# EAGLE design TowCam Rev. A (EAGLE 9.4.2)
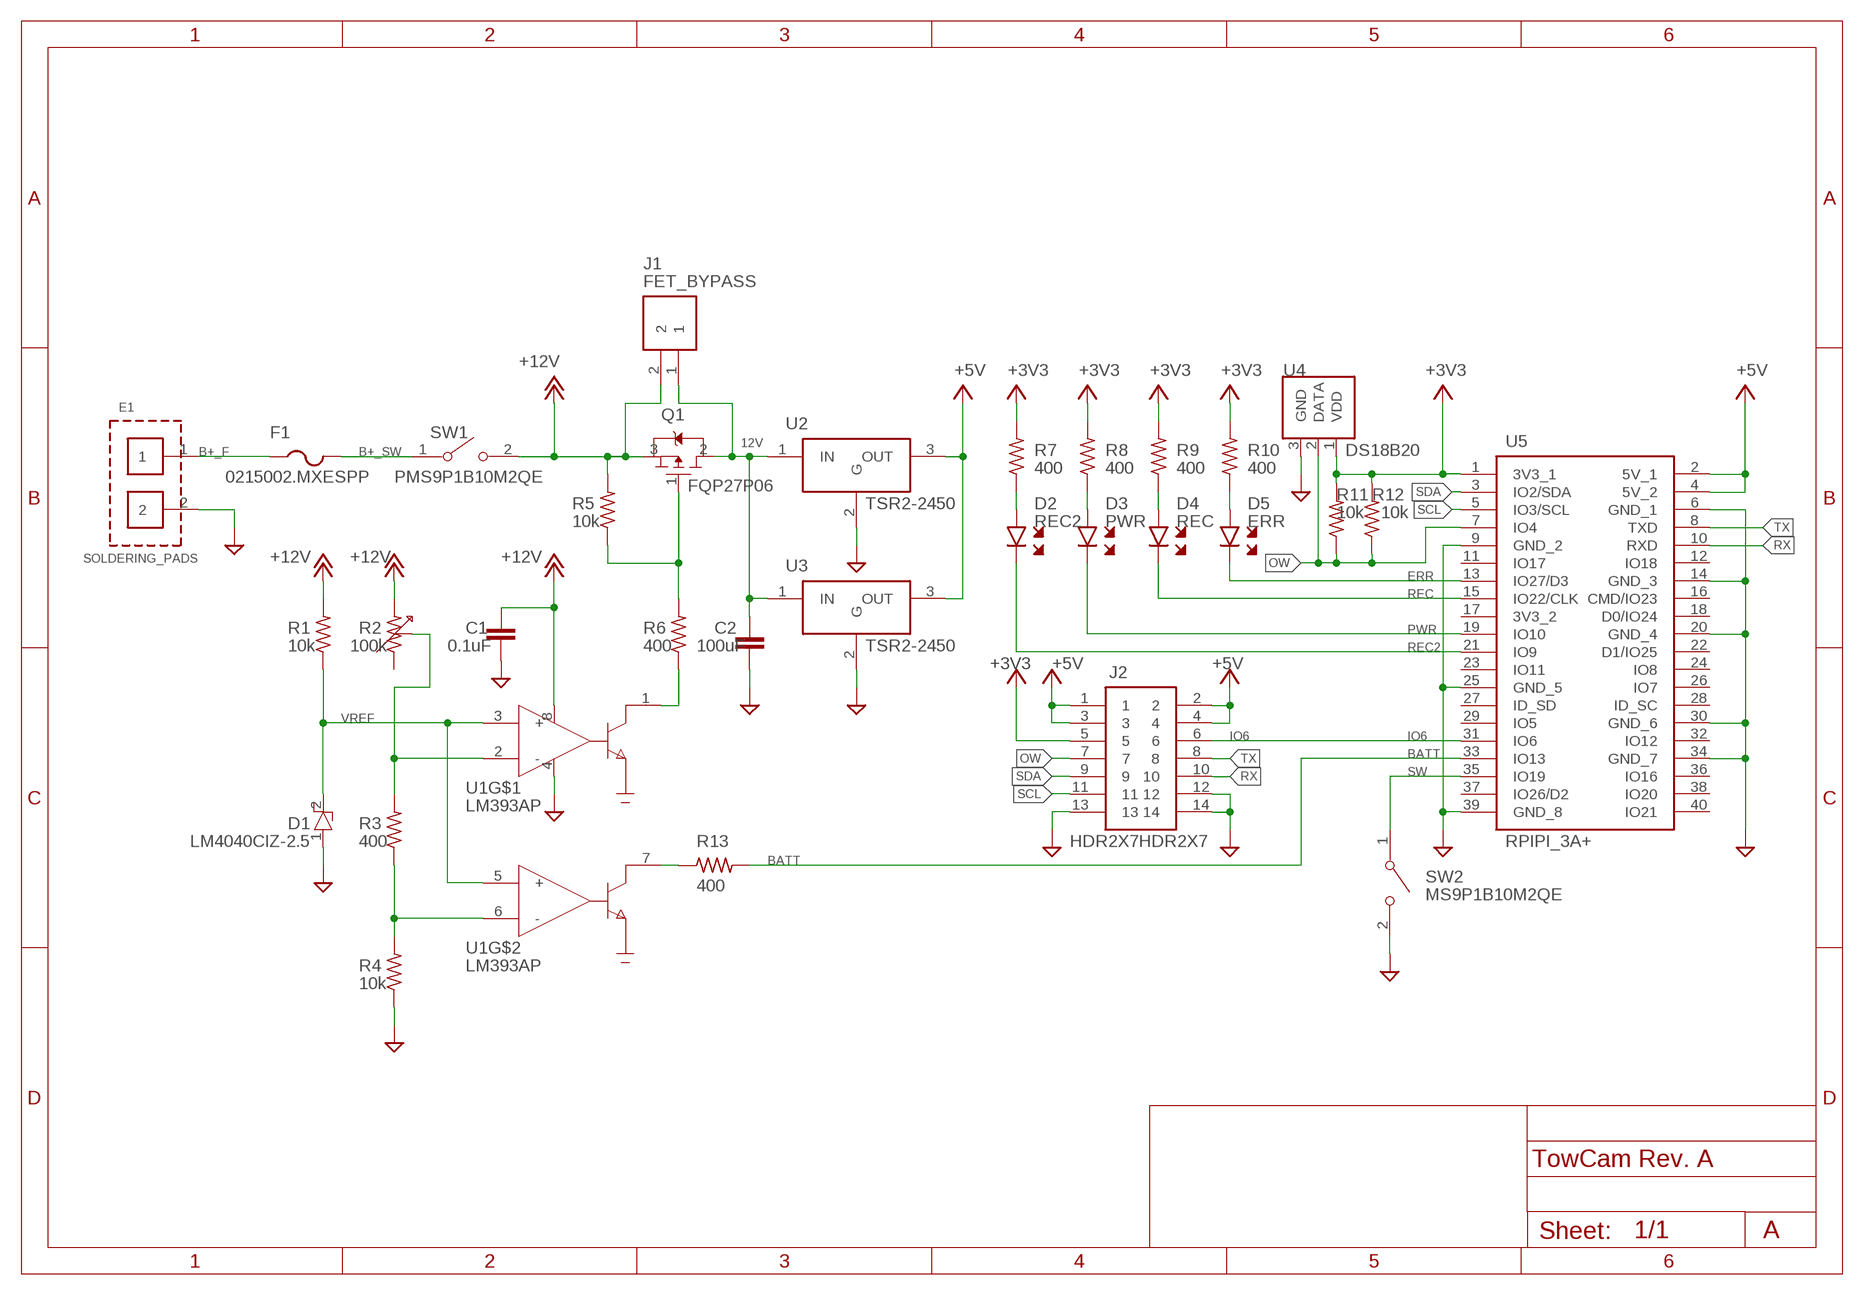
[diagram p0: schematic, sheet 1]

## Parts
C1  0.1uF  CAPACITORRAD-3MM  [CAPPRD254W65D300H300B]
C2  100uF  CAP_THCAP-TH-5MM  [CAP-TH-5MM]
D1  LM4040CIZ-2.5  ZENERLM4040CIZ-2.5  [TO-92]
D2  REC2  LED_THLED-2.54  [LEDRD254W60D565H860B]
D3  PWR  LED0805  [R0805]
D4  REC  LED0805  [R0805]
D5  ERR  LED0805  [R0805]
E1  SOLDERING_PADS  [SOLDERING_PADS]
F1  0215002.MXESPP  FUSE0215002.MXESPP  [0215002.MXESPP]
J1  FET_BYPASS  HDR1X22P2.54MM  [HDR1X2]
J2  HDR2X7HDR2X7  [HDR2X7]
Q1  FQP27P06  [TO-220-BEND]
R1  10k  RESISTOR0805  [R0805]
R2  100k  PV36W104C01B00  [PV36W104C01B00]
R3  400  RESISTOR0805  [R0805]
R4  10k  RESISTOR0805  [R0805]
R5  10k  RESISTOR0805  [R0805]
R6  400  RESISTOR0805  [R0805]
R7  400  RESISTOR0805  [R0805]
R8  400  RESISTOR0805  [R0805]
R9  400  RESISTOR0805  [R0805]
R10  400  RESISTOR0805  [R0805]
R11  10k  RESISTOR0805  [R0805]
R12  10k  RESISTOR0805  [R0805]
R13  400  RESISTOR0805  [R0805]
SW1  PMS9P1B10M2QE  SPSTPMS9P1B10M2QE  [PMS9P1B10M2QE]
SW2  MS9P1B10M2QE  SPSTPMS9P1B10M2QE  [PMS9P1B10M2QE]
U1  LM393AP  LM393APDIP8  [DIP8]
U2  TSR2-2450  [TSR2-2450]
U3  TSR2-2450  [TSR2-2450]
U4  DS18B20  [TO-92]
U5  RPIPI_3A+  [PI_3A+]

## Nets
12V: C2.1 J1.1 Q1.2(D) U2.1(IN) U3.1(IN)
+3V3: J2.5 R7.2 R8.2 R9.2 R10.2 R11.2 R12.2 U4.1(VDD) U5.1(3V3_1)
+5V: J2.1 J2.2 J2.3 J2.4 U2.3(OUT) U3.3(OUT) U5.2(5V_1) U5.4(5V_2)
+12V: C1.1 J1.2 Q1.3(S) R1.2 R2.3 R5.2 SW1.2 U1.8(VCC)
B+_F: E1.1 F1.1
B+_SW: F1.2 SW1.1
BATT: R13.2 U5.33(IO13)
ERR: D5.2 U5.13(IO27/D3)
GATE: Q1.1(G) R5.1 R6.2
GND: C1.2 C2.2 D1.1(A) E1.2 J2.12 J2.13 J2.14 R4.1 SW2.2 U1.4(GND) U2.2(G) U3.2(G) U4.3(GND) U5.6(GND_1) U5.9(GND_2) U5.14(GND_3) U5.20(GND_4) U5.25(GND_5) U5.30(GND_6) U5.34(GND_7) U5.39(GND_8)
IO6: J2.6 U5.31(IO6)
N$1: R13.1 U1.7(OUT)
N$3: R2.2 R3.2 U1.2(-)
N$4: R3.1 R4.2 U1.6(-)
N$5: D2.1 R7.1
N$6: R6.1 U1.1(OUT)
N$7: D3.1 R8.1
N$8: D4.1 R9.1
N$17: D5.1 R10.1
OW: J2.7 R11.1 R12.1 U4.2(DATA) U5.7(IO4)
PWR: D3.2 U5.19(IO10)
REC: D4.2 U5.15(IO22/CLK)
REC2: D2.2 U5.21(IO9)
RX: J2.10 U5.10(RXD)
SCL: J2.11 U5.5(IO3/SCL)
SDA: J2.9 U5.3(IO2/SDA)
SW: SW2.1 U5.35(IO19)
TX: J2.8 U5.8(TXD)
VREF: D1.2(C) R1.1 U1.3(+) U1.5(+)
Unconnected: R2.1 U5.11(IO17) U5.12(IO18) U5.16(CMD/IO23) U5.17(3V3_2) U5.18(D0/IO24) U5.22(D1/IO25) U5.23(IO11) U5.24(IO8) U5.26(IO7) U5.27(ID_SD) U5.28(ID_SC) U5.29(IO5) U5.32(IO12) U5.36(IO16) U5.37(IO26/D2) U5.38(IO20) U5.40(IO21)

## Notes on the sheet
- A

## Library data of the parts
C1 = CameraTags:CAPACITOR: Capacitor
C2 = CameraTags:CAP_TH: Capacitor Electro. TH
D1 = CameraTags:ZENER: Voltage Reference - Zener Diode
D2 = CameraTags:LED_TH: TH LED - large
D3-D5 = CameraTags:LED: LED GENERIC
E1 = CameraTags:SOLDERING_PADS: Pads for soldering wires
F1 = CameraTags:FUSE: Fuse - Various Devices
J1 = CameraTags:HDR1X2: Header 2pin 2.54mm pitch
J2 = CameraTags:HDR2X7
Q1 = CameraTags:FQP27P06: FQP27P06 ON Semiconductor P-Channel 60V 27A (Tc) 120W (Tc) Through Hole TO-220-3 https://www.digikey.com/product-detail/en/on-semiconductor/FQP27P06/FQP27P06-ND/965349
R1 R3-R13 = CameraTags:RESISTOR: Resistor US
R2 = CameraTags:PV36W104C01B00: PV36W104C01B00 Bourns Inc. 100 kOhms 0.5W, 1/2W PC Pins Through Hole Trimmer Potentiometer Cermet 25 Turn Top Adjustment https://www.digikey.ca/product-detail/en/bourns-inc/PV36W104C01B00/490-2876-ND/666503?_ga=2.74236242.1700050440.1575291731-1677524200.1568829916
SW1 SW2 = CameraTags:SPST: Switch SPST
U1 = CameraTags:LM393AP: LM393AP Texas Instruments Comparator Differential CMOS, MOS, Open-Drain, TTL 8-PDIP https://www.digikey.ca/product-detail/en/texas-instruments/LM393AP/296-6609-5-ND/372797
U2 U3 = CameraTags:TSR2-2450: TSR 2-2450 Traco Power Linear Regulator Replacement DC DC Converter 1 Output 5V 2A 6.5V - 36V Input https://www.digikey.ca/product-detail/en/traco-power/TSR-2-2450/1951-2692-ND/9383726
U4 = CameraTags:DS18B20: DS18B20+T&R Maxim Integrated Temperature Sensor Digital, Local -55°C ~ 125°C 12 b TO-92-3 https://www.digikey.ca/product-detail/en/maxim-integrated/DS18B20-T-R/DS18B20-T-RCT-ND/3478852
U5 = CameraTags:RPI: Pi Header with different package variations

## Board
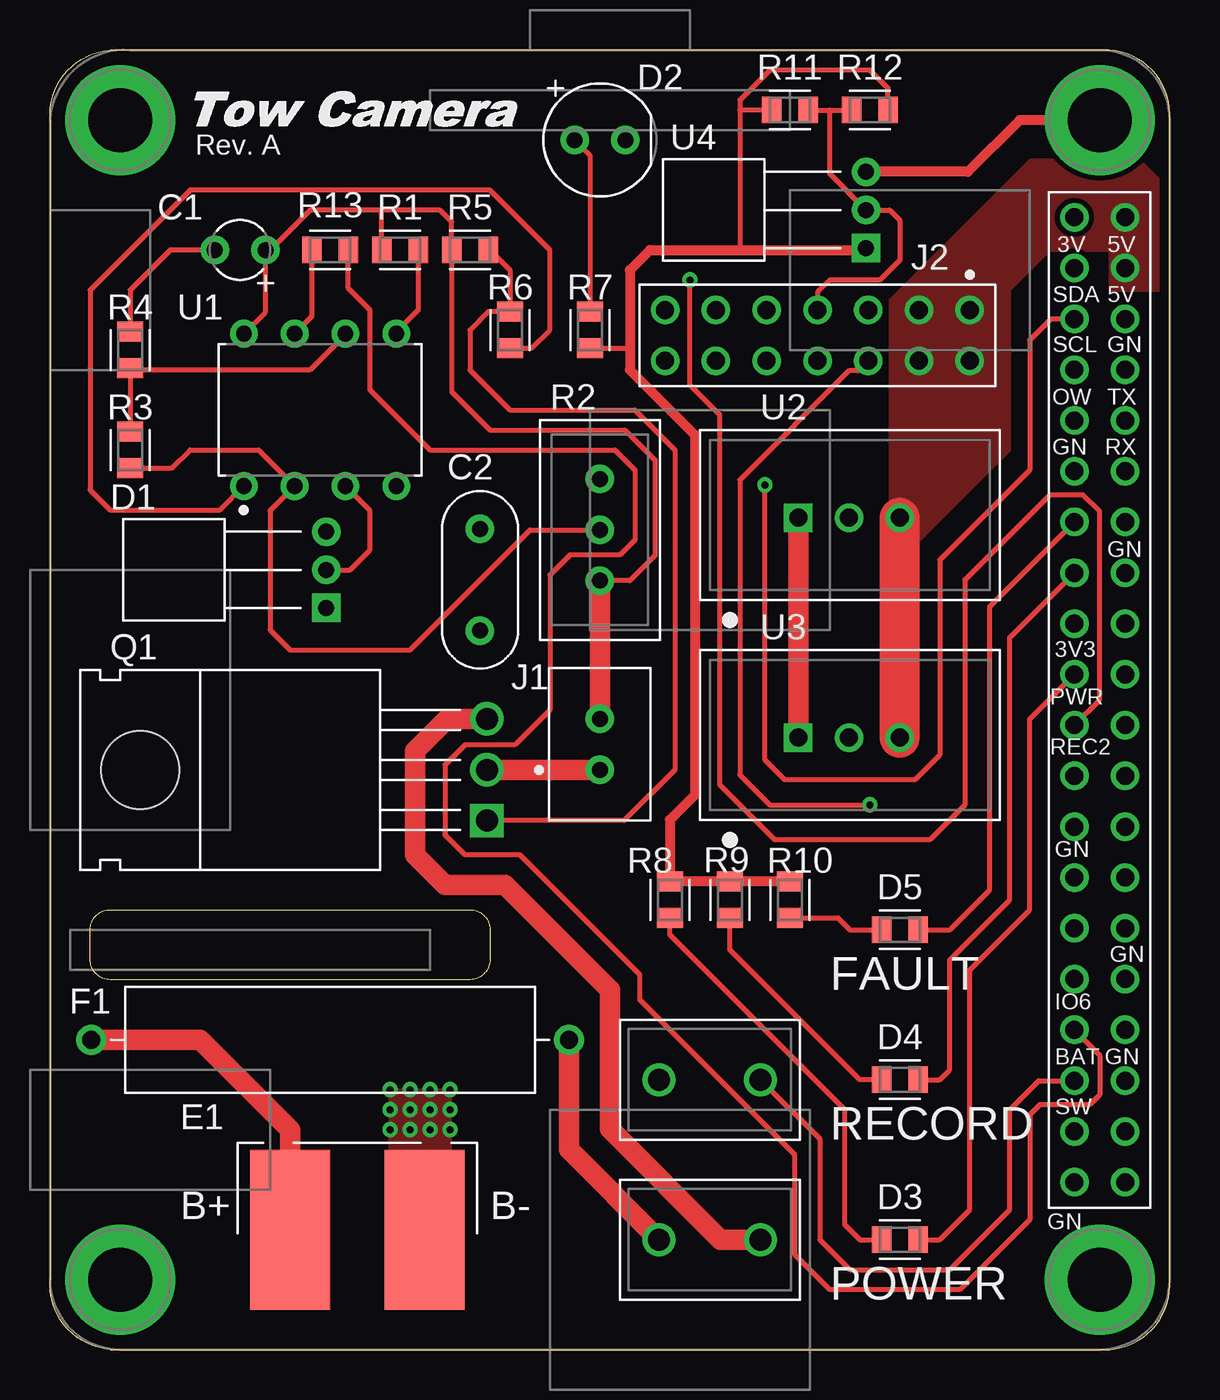
[diagram p1: board, top side]
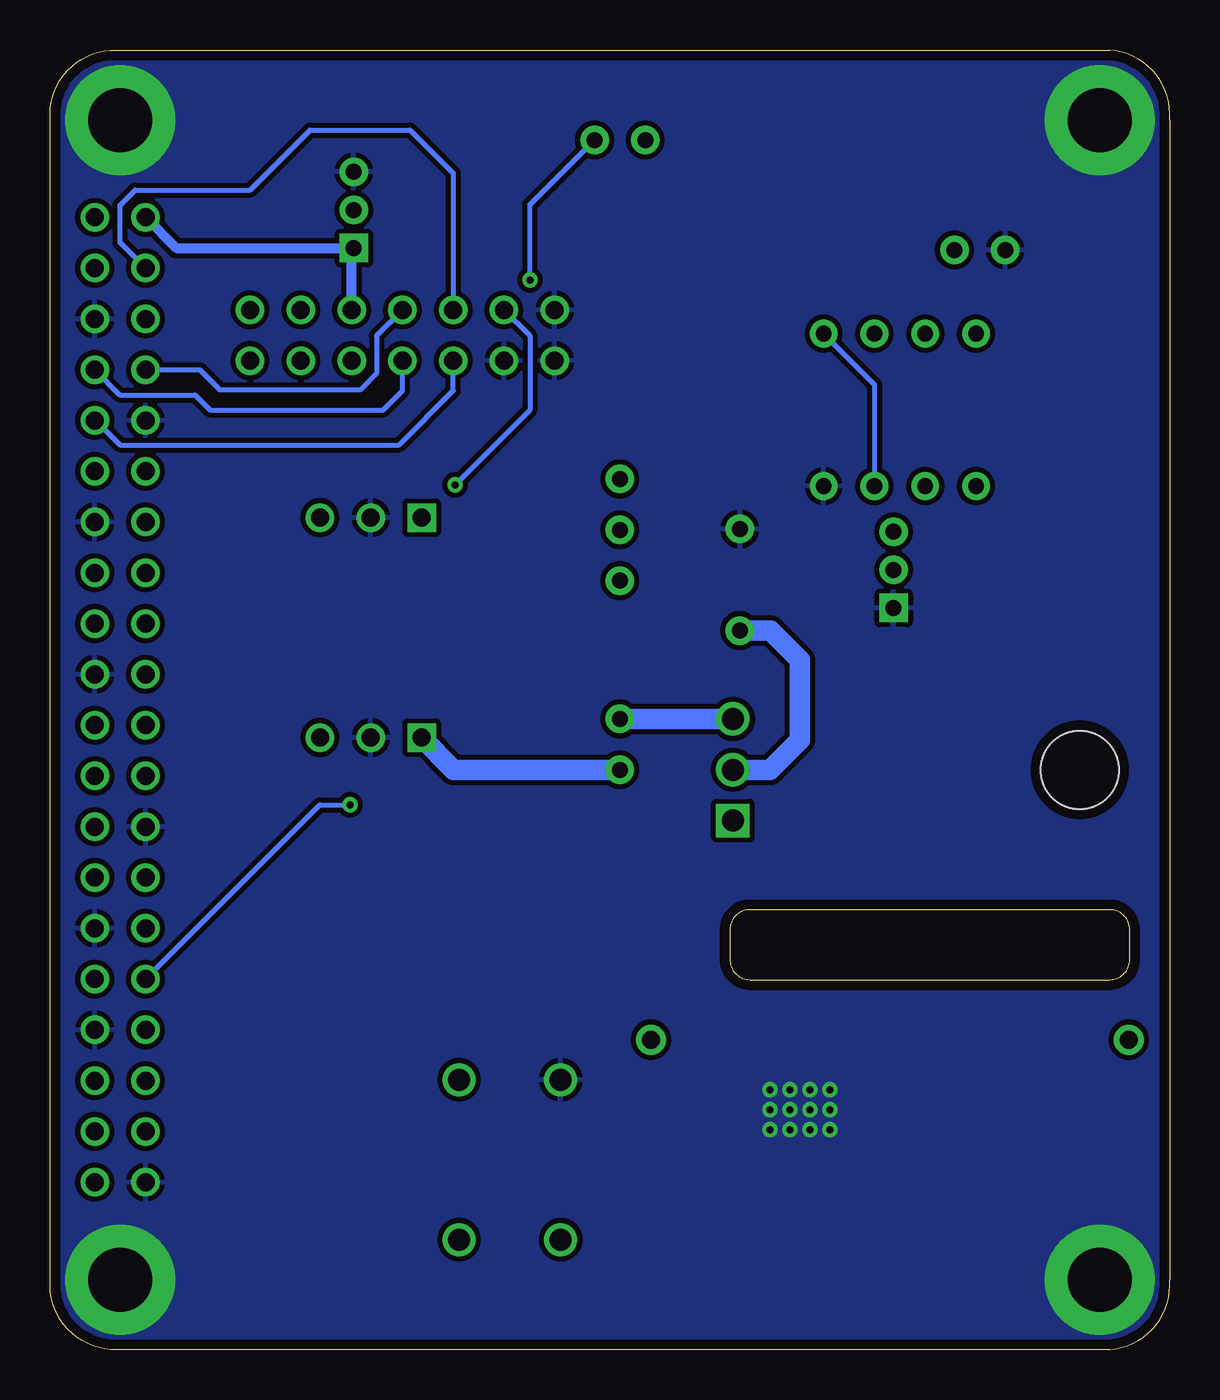
[diagram p2: board, bottom side, seen from below]

Size 56.02 x 65 mm. Coordinates in mm from the lower left corner, seen from the top.
Outline: 3.01,0 53.01,0 arc90 56.01,3.5 56.01,61.5 arc90 53.01,65 3.01,65 arc90 0.01,61.5 0.01,3.5 arc90 3.01,0
Outline: 3.01,18.5 arc-90 2.01,19.5 2.01,21 arc-90 3.01,22 21.01,22 arc-90 22.01,21 22.01,19.5 arc-90 21.01,18.5 3.01,18.5
Copper layers (1*16): Top 0.035mm / dielectric 1.5mm / Bottom 0.035mm
Design rules "default *": minimum track width 10mil, minimum drill 10mil, track to track 10mil, track to pad 10mil, pad to pad 10mil, via to via 10mil, smd to smd 10mil, copper to edge 20mil, drill to drill 10mil, minimum pad ring 10mil, minimum via ring 8mil, stop-mask expansion 4mil, vias tented up to drill 0mil, thermal gap 10mil

### Footprints (pad centres in the part's own frame; a part is rotated, then mirrored left to right if it is on the bottom)
CAPPRD254W65D300H300B = drill 0.8 pad 1.422: 1 -1.27,0; 2 1.27,0
CAP-TH-5MM = drill 0.8 pad 1.422: 1 -2.54,0; 2 2.54,0
TO-92 = drill 0.8 pad 1.422 square: 1 -1.905,-3.81 | drill 0.8 pad 1.422: 2 0,-3.81; 3 1.905,-3.81
LEDRD254W60D565H860B = drill 0.8 pad 1.422: 1 -1.27,0; 2 1.27,0
R0805 = smd 0.987 x 1.312: 1 -0.912,0; 2 0.912,0
SOLDERING_PADS = smd 8 x 4: 1 0,4; 2 0,-2.73
0215002.MXESPP = drill 0.9 pad 1.5: 1 -11.95,0; 2 11.95,0
HDR1X2 = drill 0.8 pad 1.422: 1 0,0; 2 2.54,0
HDR2X7 = drill 0.9 pad 1.422: 1 0,0; 2 0,2.54; 3 2.54,0; 4 2.54,2.54; 5 5.08,0; 6 5.08,2.54; 7 7.62,0; 8 7.62,2.54; 9 10.16,0; 10 10.16,2.54; 11 12.7,0; 12 12.7,2.54; 13 15.24,0; 14 15.24,2.54
TO-220-BEND = drill 1.1 pad 1.676 square: 1 -2.54,-10.35 | drill 1.1 pad 1.676: 2 0,-10.35; 3 2.54,-10.35 | hole 3.9: 0,7
PV36W104C01B00 = drill 0.8 pad 1.422: 1 -2.54,0; 2 0,0; 3 2.54,0
PMS9P1B10M2QE = drill 1.1: 1 0,2.54; 2 0,-2.54
DIP8 = drill 0.786 pad 1.386: 1 -3.81,3.81; 2 -3.81,1.27; 3 -3.81,-1.27; 4 -3.81,-3.81; 5 3.81,-3.81; 6 3.81,-1.27; 7 3.81,1.27; 8 3.81,3.81
TSR2-2450 = drill 0.9 pad 1.422 square: 1 4.42,3.61 | drill 0.9 pad 1.422: 2 6.96,3.61; 3 9.5,3.61
PI_3A+ = drill 0.9 pad 1.422: 1 51.23,56.63; 2 53.77,56.63; 3 51.23,54.09; 4 53.77,54.09; 5 51.23,51.55; 6 53.77,51.55; 7 51.23,49.01; 8 53.77,49.01; 9 51.23,46.47; 10 53.77,46.47; 11 51.23,43.93; 12 53.77,43.93; 13 51.23,41.39; 14 53.77,41.39; 15 51.23,38.85; 16 53.77,38.85; 17 51.23,36.31; 18 53.77,36.31; 19 51.23,33.77; 20 53.77,33.77; 21 51.23,31.23; 22 53.77,31.23; 23 51.23,28.69; 24 53.77,28.69; 25 51.23,26.15; 26 53.77,26.15; 27 51.23,23.61; 28 53.77,23.61; 29 51.23,21.07; 30 53.77,21.07; 31 51.23,18.53; 32 53.77,18.53; 33 51.23,15.99; 34 53.77,15.99; 35 51.23,13.45; 36 53.77,13.45; 37 51.23,10.91; 38 53.77,10.91; 39 51.23,8.37; 40 53.77,8.37

### Placement (x,y rotation side)
C1  9.51,55 180 top
C2  21.51,38.5 90 top
D1  10.01,39 90 top
D2  27.51,60.5 0 top
D3  42.51,5.5 0 top
D4  42.51,13.5 0 top
D5  42.51,21 0 top
E1  16.01,6 90 top
F1  14.01,15.5 0 top
J1  27.51,29 90 top
J2  46.01,52 180 top
Q1  11.51,29 90 top
R1  17.51,55 180 top
R2  27.51,41 270 top
R3  4.01,45 270 top
R4  4.01,50 270 top
R5  21.01,55 180 top
R6  23.01,51 90 top
R7  27.01,51 270 top
R8  31.01,22.5 90 top
R9  34.01,22.5 90 top
R10  37.01,22.5 90 top
R11  37.01,62 180 top
R12  41.01,62 0 top
R13  14.01,55 0 top
SW1  33.01,5.5 90 top
SW2  33.01,13.5 270 top
U1  13.51,47 90 top
U2  33.01,38 0 top
U3  33.01,27 0 top
U4  37.01,57 90 top
U5  0.01,0 0 top

### Tracks (layer width: path | path; a pad name or v marks a point on that pad's centre or on a via)
12V
  Top 1.016: U2.1 U3.1 | Q1.2 J1.1
  Bottom 1.016: U3.1 35.82,29 J1.1 | Q1.2 20.01,29 18.51,30.5 18.51,34.5 19.97,35.96 C2.1
+3V3
  Top 0.254: R12.2 41.92,63.09 41.01,64 36.01,64 34.51,62.5 34.51,62 | 34.51,62 34.51,55 | U4.1 40.72,55 | R11.2 34.51,62 | R7.2 28.92,50.09 29.01,50
  Top 0.508: 40.72,55 34.51,55 30.01,55 29.01,54 29.01,50 29.01,49 32.26,45.75 32.26,27.75 31.01,26.5 R8.2 R9.2 R10.2
  Bottom 0.508: U5.1 49.7,55.09 U4.1 40.93,54.98 J2.5
+5V
  Top 2: U3.3 U2.3
  pour Top (isolate 0.254, no thermals): 42.01,39 48.01,45 48.01,53 50.01,55 53.01,55 53.01,53 55.51,53 55.51,58.5 54.51,59.5 49.01,59.5 42.01,52.5
+12V
  Top 0.254: U1.8 10.78,51.89 C1.1 11.01,55 13.01,57 16.6,57 | 16.6,57 19.51,57 20.1,56.41 R5.2 20.1,47.91 22.01,46 28.76,46 30.26,44.5 30.26,39.71 29.01,38.46 R2.3 | R1.2 16.6,57
  Top 1.016: SW1.2 33.55,5.5 28.01,11.04 28.01,18 22.76,23.25 19.76,23.25 18.26,24.75 18.26,29.94 19.86,31.54 Q1.3 | R2.3 J1.2
  Bottom 1.016: Q1.3 J1.2
B+_F
  Top 1.016: E1.1 12.01,11 7.51,15.5 F1.1
B+_SW
  Top 1.016: F1.2 25.96,10.01 SW1.1
BATT
  Top 0.254: U5.33 52.51,14.72 52.51,12.75 52.01,12.25 49.51,12.25 49.01,11.75 49.01,6.5 45.51,3 39.01,3 37.26,4.75 37.26,9.75 29.51,17.5 29.51,18.75 23.51,24.75 20.76,24.75 19.76,25.75 19.76,29.25 20.76,30.25 23.26,30.25 25.01,32 25.01,38.75 26.01,39.75 28.51,39.75 29.26,40.5 29.26,44 28.26,45 19.01,45 16.01,48 16.01,52 14.92,53.09 R13.2
ERR
  Top 0.254: D5.2 45.01,21 47.01,23 47.01,37.16 U5.13
GATE
  Top 0.254: R5.1 22.01,55 23.01,54 R6.2 21.92,51.91 21.01,51 21.01,49 23.01,47 29.26,47 31.26,45 31.26,29 28.72,26.46 Q1.1
GND  (via drill 0.35, 3.2 pad 5.5)
  Top 0.254: C1.2 6.01,55 4.01,53 R4.1
  Top 0.508: v52.51,61.5 48.51,61.5 45.91,58.91 U4.3
  other vias: 3.51,61.5 52.51,3.5 3.51,3.5 20.01,13 20.01,12 20.01,11 19.01,13 19.01,12 19.01,11 18.01,11 18.01,12 18.01,13 17.01,13 17.01,12 17.01,11
  pour Bottom (isolate 0.254): 0.01,0 0.01,65 56.01,65 56.01,0
  pour Top (isolate 0.254, no thermals): 17.01,9.5 17.01,13 20.01,13 20.01,10 20.01,9.5
IO6  (via drill 0.35)
  Top 0.254: J2.6 40.43,48.96 39.97,48.96 34.51,43.5 34.51,28.75 36.01,27.25 v41.01,27.25
  Bottom 0.254: U5.31 42.52,27.25 v41.01,27.25
N$1
  Top 0.254: R13.1 13.1,51.67 U1.7
N$3
  Top 0.254: R3.2 6.1,44.09 7.01,45 10.43,45 U1.2 11.01,41.96 11.01,36 12.01,35 18.01,35 24.01,41 R2.2
N$4
  Top 0.254: R3.1 R4.2 4.1,49 13.01,49 14.78,50.77 U1.6
N$5
  Top 0.254: D2.1 27.01,59.73 R7.1
N$6
  Top 0.254: R6.1 24.1,50.09 25.01,51 25.01,55 22.01,58 7.01,58 2.01,53 2.01,43 3.01,42 8.51,42 U1.1
N$7
  Top 0.254: D3.1 40.51,5.5 39.76,6.25 39.76,12 31.01,20.75 R8.1
N$8
  Top 0.254: D4.1 40.51,13.5 34.01,20 R9.1
N$17
  Top 0.254: R10.1 39.42,21.59 40.01,21 D5.1
OW
  Top 0.254: R11.1 39.01,62 | 39.01,62 R12.1 | 39.01,62 39.01,58.81 U4.2 42.01,57 42.51,56.5 42.51,54.5 41.51,53.5 39.01,53.5 38.39,52.88 J2.7
  Bottom 0.254: U5.7 48.52,49.01 47.51,48 40.51,48 39.68,48.83 39.68,50.7 J2.7
PWR
  Top 0.254: D3.2 44.51,5.5 46.01,7 46.01,19 49.01,22 49.01,31.54 U5.19
REC
  Top 0.254: D4.2 44.51,13.5 45.01,14 45.01,19.5 48.01,22.5 48.01,35.62 U5.15
REC2  (via drill 0.35)
  Top 0.254: U5.21 52.51,32.5 52.51,41.91 51.67,42.75 50.01,42.75 45.76,38.5 45.76,27.25 44.01,25.5 36.26,25.5 33.51,28.25 33.51,46.75 32.01,48.25 v32.01,53.5
  Bottom 0.254: v32.01,53.5 32.01,57.27 D2.2
RX
  Bottom 0.254: U5.10 53.73,46.47 52.51,45.25 38.56,45.25 35.85,47.96 J2.10
SCL  (via drill 0.35)
  Top 0.254: U5.5 50.06,51.55 49.01,50.5 49.01,44 44.51,39.5 44.51,29.75 43.26,28.5 36.76,28.5 35.76,29.5 v35.76,43.25
  Bottom 0.254: J2.11 32.01,50.7 32.01,47 v35.76,43.25
SDA
  Bottom 0.254: U5.3 52.51,55.36 52.51,57.25 51.76,58 46.01,58 43.01,61 38.01,61 35.85,58.84 J2.9
SW
  Top 0.254: SW2.1 38.51,10.54 38.51,5.5 40.01,4 45.01,4 48.01,7 48.01,12 49.46,13.45 U5.35
TX
  Bottom 0.254: U5.8 52.52,47.75 48.76,47.75 48.01,47 39.35,47 38.39,47.96 J2.8
VREF
  Top 0.254: R1.1 18.42,52 17.32,50.9 U1.5 | D1.2 15.01,39 16.01,40 16.01,41.96 U1.3
  Bottom 0.254: U1.5 14.78,48.27 U1.3

### Text on the board
tPlace: Rev. A | 3V | 5V | SDA | 5V | SCL | GN | OW | TX | GN | RX | GN | 3V3 | PWR | REC2 | GN | GN | FAULT | IO6 | BAT | GN | SW | RECORD | B+ | B- | GN | POWER